# EAGLE design mosfet-h-bridge-v1-0805 (EAGLE 6.1)
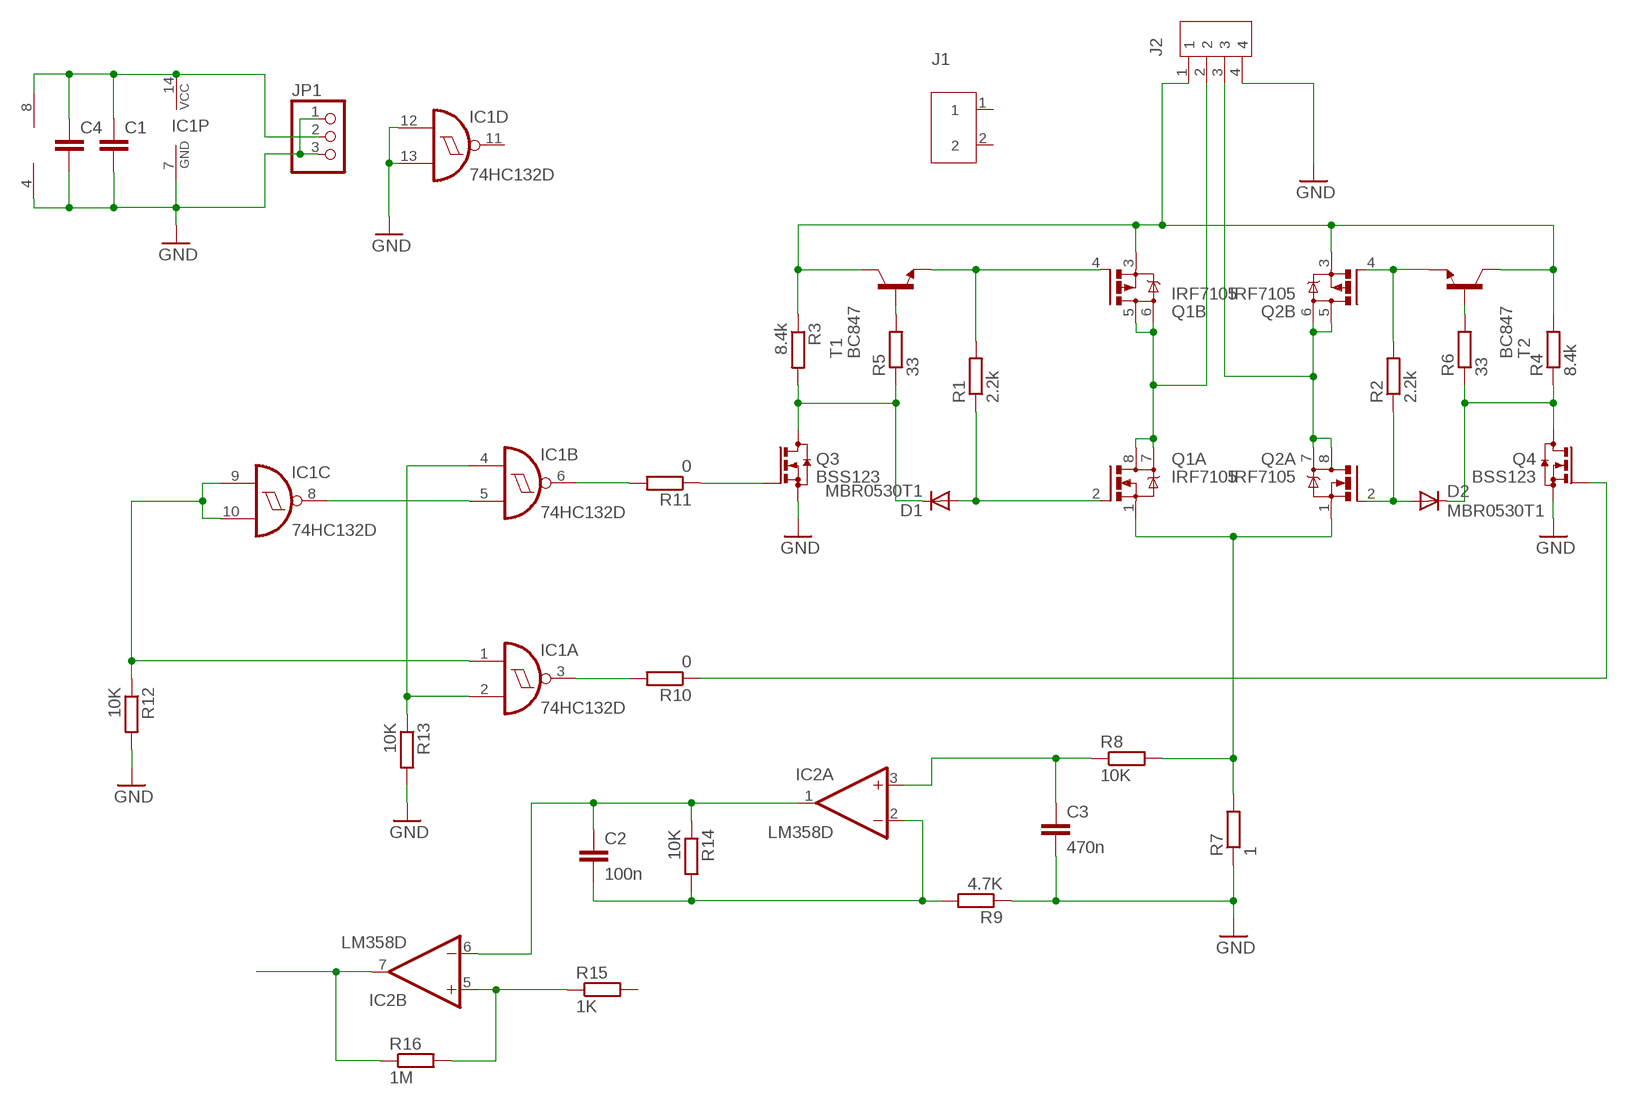
[diagram p0: schematic, sheet 1]

## Parts
C1  C-EUC0805  [C0805]
C2  100n  C-EUC0805  [C0805]
C3  470n  C-EUC0805  [C0805]
C4  C-EUC0805  [C0805]
D1  MBR0530T1  [SOD123]
D2  MBR0530T1  [SOD123]
IC1  74HC132D  [SO14]
IC2  LM358D  [SO08]
J1  SCREW-TERMINAL-2P  [2P-3.36]
J2  SCREW-TERMINAL-4P  [4P-3.36]
JP1  PINHD-1X3  [1X03]
Q1  IRF7105  [SO08]
Q2  IRF7105  [SO08]
Q3  BSS123  [SOT23]
Q4  BSS123  [SOT23]
R1  2.2k  R-EU_R0805  [R0805]
R2  2.2k  R-EU_R0805  [R0805]
R3  8.4k  R-EU_R0805  [R0805]
R4  8.4k  R-EU_R0805  [R0805]
R5  33  R-EU_R0805  [R0805]
R6  33  R-EU_R0805  [R0805]
R7  1  R-EU_R2512  [R2512]
R8  10K  R-EU_R0805  [R0805]
R9  4.7K  R-EU_R0805  [R0805]
R10  0  R-EU_R0805  [R0805]
R11  0  R-EU_M0805  [M0805]
R12  10K  R-EU_R0805  [R0805]
R13  10K  R-EU_R0805  [R0805]
R14  10K  R-EU_R0805  [R0805]
R15  1K  R-EU_R0805  [R0805]
R16  1M  R-EU_R0805  [R0805]
T1  BC847  [SOT23]
T2  BC847  [SOT23]

## Nets
GND: C1.2 C3.2 C4.2 IC1.7(P:GND) IC1.12(D:I0) IC1.13(D:I1) IC2.4(P:V-) J2.4 JP1.1 JP1.3 Q3.2(S) Q4.2(S) R7.1 R9.1 R12.2 R13.2
N$1: D1.A Q1.2(A:G) R1.1
N$2: J2.2 Q1.5(B:D) Q1.6(B:D1) Q1.7(A:D1) Q1.8(A:D)
N$3: Q1.4(B:G) R1.2 T1.2(E)
N$4: Q2.4(B:G) R2.2 T2.2(E)
N$5: Q1.1(A:S) Q2.1(A:S) R7.2 R8.2
N$7: D2.A Q2.2(A:G) R2.1
N$8: D1.C Q3.3(D) R3.2 R5.1
N$9: R5.2 T1.1(B)
N$10: J2.1 Q1.3(B:S) Q2.3(B:S) R3.1 R4.2 T1.3(C) T2.3(C)
N$12: D2.C Q4.3(D) R4.1 R6.1
N$13: R6.2 T2.1(B)
N$14: C3.1 IC2.3(A:+IN) R8.1
N$15: J2.3 Q2.5(B:D) Q2.6(B:D1) Q2.7(A:D1) Q2.8(A:D)
N$16: C2.2 IC2.2(A:-IN) R9.2 R14.2
N$17: C1.1 C4.1 IC1.14(P:VCC) IC2.8(P:V+) JP1.2
N$18: IC1.6(B:O) R11.2
N$19: Q4.1(G) R10.1
N$20: IC1.1(A:I0) IC1.9(C:I0) IC1.10(C:I1) R12.1
N$21: IC1.2(A:I1) IC1.4(B:I0) R13.1
N$22: IC1.5(B:I1) IC1.8(C:O)
N$23: IC1.3(A:O) R10.2
N$24: IC2.5(B:+IN) R15.1 R16.2
N$25: IC2.7(B:OUT) R16.1
N$32: Q3.1(G) R11.1
N$36: C2.1 IC2.1(A:OUT) IC2.6(B:-IN) R14.1
Unconnected: IC1.11(D:O) J1.1 J1.2 R15.2

## Library data of the parts
C1-C4 = rcl:C-EU: CAPACITOR, European symbol
D1 D2 = smirnov-arkady-all:MBR0530T1: SCHOTTKY BARRIER RECTIFIER Source: http://onsemi.com .. MBR0520LT1-D.pdf
IC1 = 74xx-eu:74*132: Quad 2-input NAND schmitt trigger
IC2 = linear:LM358: OP AMP also LM158; LM258; LM2904 Source: http://cache.national.com/ds/LM/LM158.pdf
J1 = Connector:SCREW-TERMINAL-2P
J2 = Connector:SCREW-TERMINAL-4P
JP1 = pinhead:PINHD-1X3: PIN HEADER
Q1 Q2 = 0-svo-motor-mosfet:IRF7105
Q3 Q4 = transistor-small-signal:BSS123: N-CHANNEL MOS FET
R1-R6 R8-R16 = rcl:R-EU_: RESISTOR, European symbol
R7 = resistor:R-EU_: RESISTOR, European symbol
T1 T2 = transistor:BC847: NPN TRANSISTOR

## Board
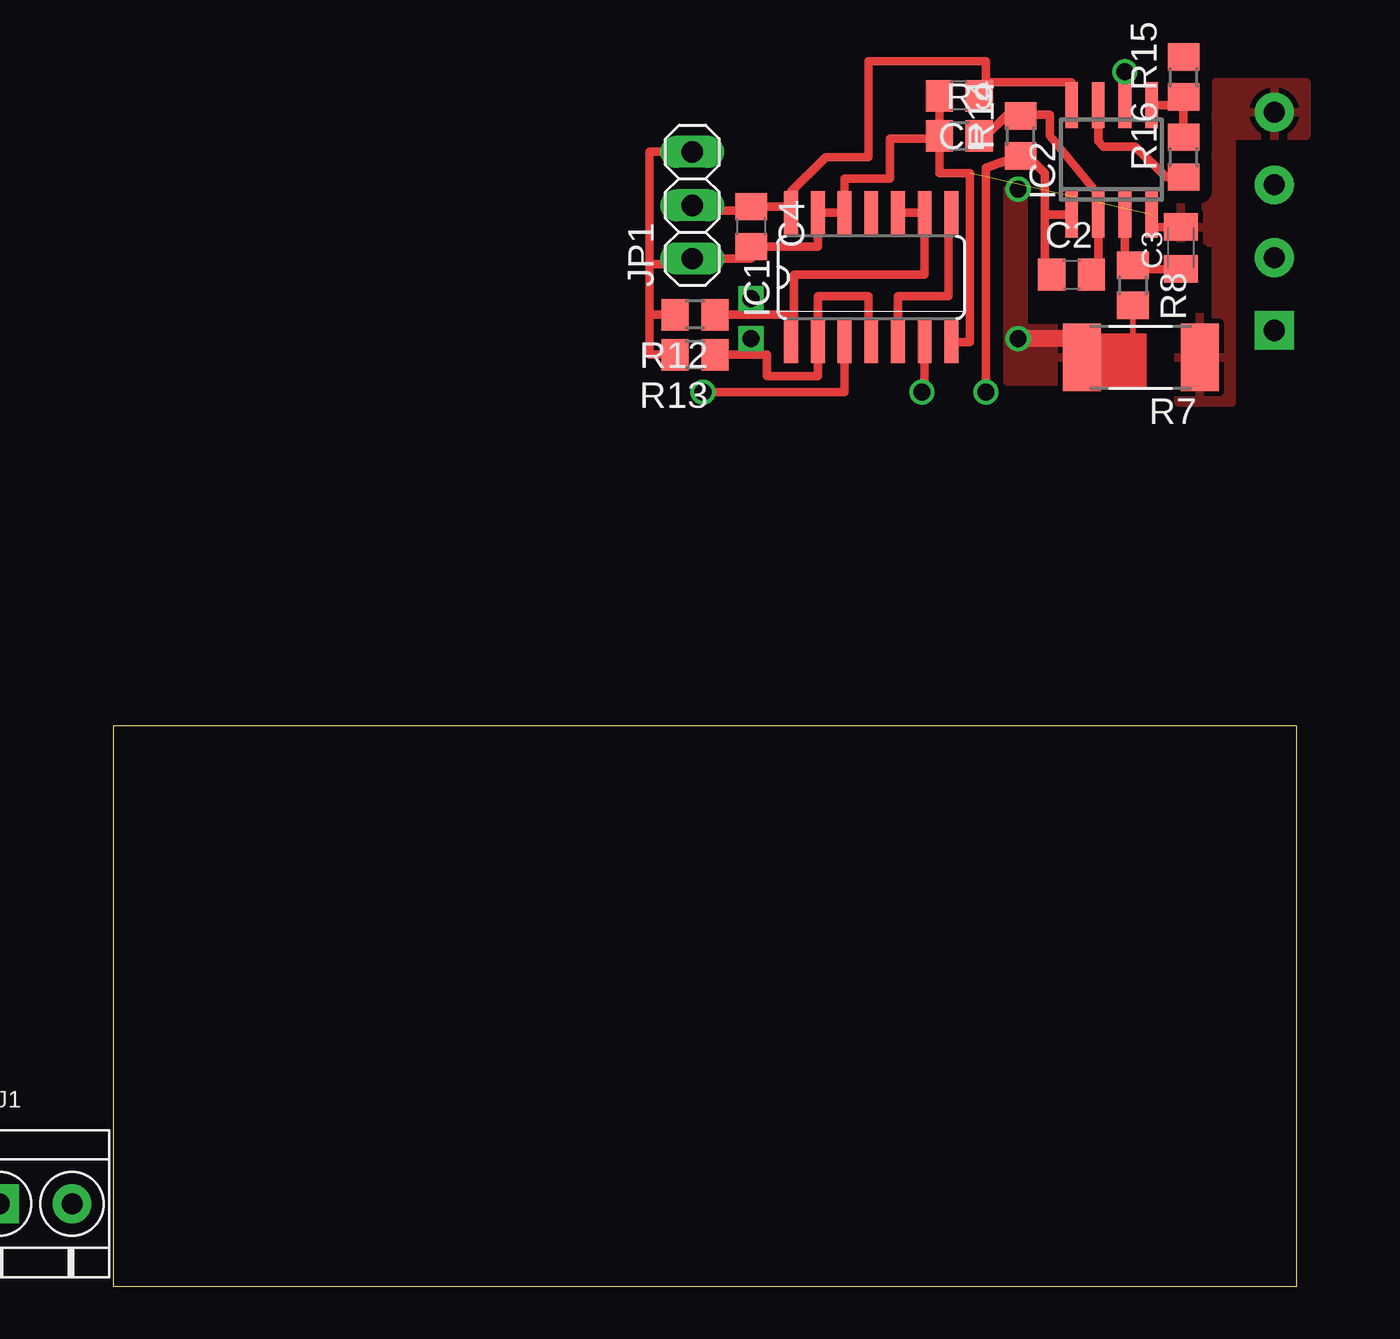
[diagram p1: board, top side]
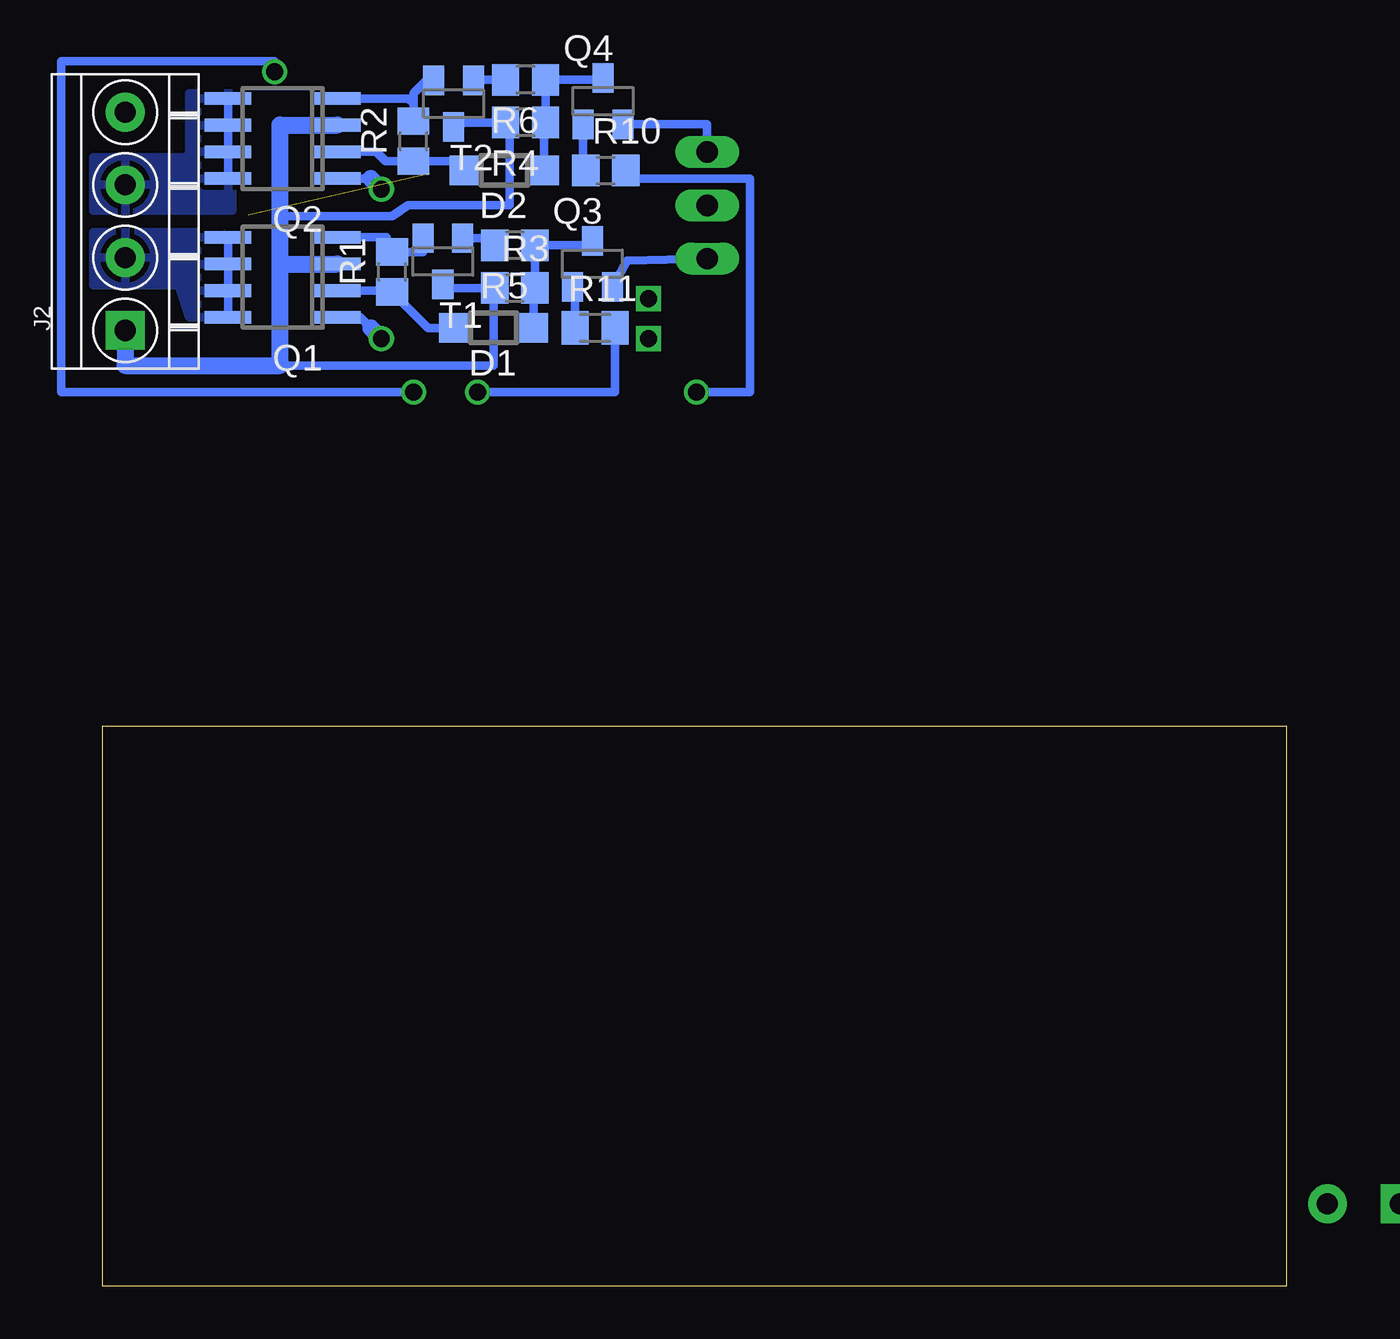
[diagram p2: board, bottom side, seen from below]

Size 56.31 x 26.66 mm. Coordinates in mm from the lower left corner, seen from the top.
Outline: 56.31,0 56.31,26.66 0,26.66 0,0 56.31,0
Copper layers (1*16): Top 0.035mm / dielectric 1.5mm / Bottom 0.035mm
Design rules: minimum track width 6mil, minimum drill 12mil, track to track 6mil, track to pad 6mil, pad to pad 6mil, via to via 6mil, smd to smd 0mil, copper to edge 10mil, drill to drill 10mil, minimum pad ring 10mil, minimum via ring 6mil, stop-mask expansion 2mil, vias tented up to drill 100mil, thermal gap 10mil

### Footprints (pad centres in the part's own frame; a part is rotated, then mirrored left to right if it is on the bottom)
C0805 = smd 1.3 x 1.5: 1 -0.95,0; 2 0.95,0
C0805K = smd 1.3 x 1.6: 1 -1,0; 2 1,0
SOD123 = smd 1.4 x 1.4: A 1.9,0; C -1.9,0
SO14 = smd 0.66 x 2.032: 1 -3.81,-3.073; 2 -2.54,-3.073; 3 -1.27,-3.073; 4 0,-3.073; 5 1.27,-3.073; 6 2.54,-3.073; 7 3.81,-3.073; 8 3.81,3.073; 9 2.54,3.073; 10 1.27,3.073; 11 0,3.073; 12 -1.27,3.073; 13 -2.54,3.073; 14 -3.81,3.073
SO08 = smd 0.6 x 2.2: 1 -1.905,-2.6; 2 -0.635,-2.6; 3 0.635,-2.6; 4 1.905,-2.6; 5 1.905,2.6; 6 0.635,2.6; 7 -0.635,2.6; 8 -1.905,2.6
2P-3.36 = drill 1 pad 1.85 square: 1 -1.73,0 | drill 1 pad 1.85: 2 1.73,0
4P-3.36 = drill 1 pad 1.85 square: 1 -5.19,0 | drill 1 pad 1.85: 2 -1.73,0; 3 1.73,0; 4 5.19,0
1X03 = drill 1.016 long: 1 -2.54,0; 2 0,0; 3 2.54,0
SOT23 = smd 1 x 1.4: 1 -0.95,-1.1; 2 0.95,-1.1; 3 0,1.1
R0805 = smd 1.3 x 1.5: 1 -0.95,0; 2 0.95,0
R2512 = smd 1.8 x 3.2: 1 -2.8,0; 2 2.8,0
M0805 = smd 1.3 x 1.6: 1 -0.95,0; 2 0.95,0

### Placement (x,y rotation side)
C1  40.26,56.64 180 top  (outside the outline)
C2  45.59,48.13 0 top  (outside the outline)
C3  470n  [C0805K]  50.8,49.4 90 top  (outside the outline)
C4  30.35,50.42 270 top  (outside the outline)
D1  37.72,45.59 180 bottom  (outside the outline)
D2  37.21,53.09 180 bottom  (outside the outline)
IC1  36.07,48.01 0 top  (outside the outline)
IC2  47.5,53.59 0 top  (outside the outline)
J1  -3.68,3.94 0 top
J2  55.24,50.67 90 bottom  (outside the outline)
JP1  27.56,51.44 90 top  (outside the outline)
Q1  47.75,48.01 90 bottom  (outside the outline)
Q2  47.75,54.61 90 bottom  (outside the outline)
Q3  33.02,48.64 0 bottom  (outside the outline)
Q4  32.51,56.39 0 bottom  (outside the outline)
R1  42.55,48.26 90 bottom  (outside the outline)
R2  41.53,54.48 90 bottom  (outside the outline)
R3  36.7,47.5 0 bottom  (outside the outline)
R4  36.2,55.37 180 bottom  (outside the outline)
R5  36.7,49.53 180 bottom  (outside the outline)
R6  36.2,57.4 180 bottom  (outside the outline)
R7  48.9,44.2 180 top  (outside the outline)
R8  48.51,47.62 270 top  (outside the outline)
R9  40.26,54.74 0 top  (outside the outline)
R10  32.39,53.09 0 bottom  (outside the outline)
R11  32.89,45.59 0 bottom  (outside the outline)
R12  27.69,46.23 180 top  (outside the outline)
R13  27.69,44.32 180 top  (outside the outline)
R14  43.18,54.74 90 top  (outside the outline)
R15  50.93,57.53 90 top  (outside the outline)
R16  50.93,53.72 90 top  (outside the outline)
T1  40.13,48.77 180 bottom  (outside the outline)
T2  39.62,56.26 180 bottom  (outside the outline)

### Tracks (layer width: path | path; a pad name or v marks a point on that pad's centre or on a via)
GND  (1 unrouted)
  Top 0.406: IC2.4 49.4,50.4 C3.2 | C1.2 R9.1 | JP1.3 25.53,53.98 25.53,48.64 | 25.53,48.64 27.3,48.64 JP1.1 30.35,48.9 C4.2 33.53,49.47 IC1.13 IC1.12 34.8,52.71 36.96,52.71 36.96,54.61 39.31,54.61 R9.1 | IC1.7 40.77,44.93 40.77,52.96 39.31,52.96 R9.1 | R12.2 25.53,46.23 | 25.53,46.23 25.53,48.64 | R13.2 25.53,44.32 25.53,46.23
  Bottom 0.406: Q3.2 31.37,48.81 JP1.1 | Q4.2 27.56,55.29 JP1.3
  pour Top (isolate 0.61): 56.77,54.74 56.77,57.28 52.45,57.28 52.45,51.69 50.67,51.69 50.67,49.66 52.45,49.66 52.45,46.1 50.67,46.1 50.67,42.04 53.21,42.04 53.21,54.74
N$1
  Bottom 0.406: Q1.2 42.55,47.37 R1.1 40.83,45.59 D1.A
N$2
  Bottom 0.406: Q1.8 Q1.7 Q1.6 Q1.5
  pour Bottom: 56.77,47.62 56.77,50.16 50.67,50.16 50.67,46.1 52.2,46.1 52.7,47.62
N$3
  Bottom 0.406: T1.2 41.08,49.21 R1.2 42.8,49.21 42.8,49.91 Q1.4
N$4
  Bottom 0.406: 41.53,56.26 41.53,56.77 40.94,57.36 T2.2 40.74,57.53 | 41.53,56.26 R2.2 | Q2.4 41.78,56.52 41.53,56.26
N$5  (via drill 0.8)
  Top 0.254: 46.09,45.09 48.51,45.09 R8.2
  Top 0.406: 46.09,45.09 R7.2
  Top 0.813: 46.09,45.09 v43.05,45.09
  Bottom 0.406: Q2.1 43.56,52.71 | Q1.1 44.07,46.1 43.56,45.59
  Bottom 0.813: 43.56,52.71 v43.05,52.2 | 43.56,45.59 v43.05,45.09
  pour Top: 45.59,43.05 42.55,43.05 42.55,52.2 43.31,52.2 43.31,45.59 45.59,45.59
N$7
  Bottom 0.406: D2.A 39.56,53.53 R2.1 42.87,53.53 43.31,53.98 Q2.2
N$8
  Bottom 0.406: D1.C 35.82,47.43 R3.2 R5.1 33.23,49.53 Q3.3
N$9
  Bottom 0.406: T1.1 37.99,49.87 R5.2
N$10
  Bottom 0.406: R3.1 37.72,47.5 | 37.72,47.5 37.72,43.82 47.88,43.82 | 37.72,47.5 40.13,47.5 T1.3 | T2.3 39.62,55.37 R4.2 36.96,55.37 36.96,51.44 41.78,51.44 42.55,50.93 47.62,50.93 47.88,51.18
  Bottom 0.813: 47.88,48.64 47.88,43.82 55.24,43.82 J2.1 | 47.88,48.64 Q1.3 | Q2.3 47.88,55.25 47.88,51.18 47.88,48.64
N$12
  Bottom 0.406: D2.C 35.31,55.31 R4.1 R6.1 32.6,57.4 Q4.3
N$13
  Bottom 0.406: R6.2 38.67,57.4 T2.1
N$14
  Top 0.406: IC2.3 48.13,48.32 R8.1 48.51,48.4 C3.1
N$15
  Bottom 0.406: Q2.5 Q2.8
  pour Bottom: 56.77,53.72 56.77,51.18 50.16,51.18 50.16,56.77 52.2,56.77 52.2,53.72
N$16
  Top 0.406: C2.2 arc90 46.86,48.45 IC2.2 46.86,51.94 44.58,54.74 44.58,55.75 43.25,55.75 R14.2 43.11,55.75 42.55,55.75 41.53,54.74 R9.2
N$17
  Top 0.406: C1.1 41.46,57.28 41.53,57.28 | 41.53,57.28 45.59,57.28 IC2.8 | 41.53,57.28 41.53,58.29 35.94,58.29 35.94,53.72 33.91,53.72 32.26,52.07 IC1.14 31.97,51.37 C4.1 30.16,51.18 28.83,51.18 28.57,51.44 JP1.2
N$18  (via drill 0.8)
  Top 0.406: IC1.6 38.61,42.67 arc-90 v38.48,42.55
  Bottom 0.406: v38.48,42.55 31.94,42.55 R11.2
N$19
  Bottom 0.406: Q4.1 33.46,53.21 R10.1
N$20
  Top 0.406: IC1.10 IC1.9 38.61,48.13 32.39,48.13 32.39,46.23 | IC1.1 32.39,44.93 32.39,46.23 | R12.1 32.39,46.23
N$21
  Top 0.406: IC1.4 35.94,44.93 35.94,47.12 33.53,47.12 IC1.2 33.53,43.31 31.12,43.31 31.12,44.32 R13.1
N$22
  Top 0.406: IC1.8 39.75,51.08 39.75,47.12 37.34,47.12 IC1.5
N$23  (via drill 0.8)
  Top 0.406: v28.07,42.55 34.8,42.55 IC1.3
  Bottom 0.406: R10.2 31.43,52.71 25.53,52.71 25.53,42.55 v28.07,42.55
N$24
  Top 0.406: R16.2 R15.1 50.54,56.19 IC2.5
N$25
  Top 0.406: R16.1 50.1,52.77 48.64,54.23 47.12,54.23 46.86,54.48 IC2.7
N$26  (via drill 0.8)
  other vias: 30.35,46.99
N$28  (via drill 0.8)
  other vias: 30.35,45.09
N$32
  Bottom 0.406: R11.1 33.84,47.41 Q3.1
N$36  (via drill 0.8)
  Top 0.406: IC2.1 44.32,50.99 | 44.32,50.99 44.32,52.96 43.49,53.79 R14.1 41.53,53.21 v41.53,42.55 | C2.1 44.32,48.45 44.32,50.99 | IC2.6 v48.13,57.79
  Bottom 0.406: v48.13,57.79 48.13,58.29 58.29,58.29 58.29,42.55 v41.53,42.55
(copper drawn outside any net)
  shapes: Top area x1